# Altium schematic sheet Connectors.SchDoc: STM32 LoRa Node
size A4; Author: Leon Baždar; CompanyName: FER; Address1: Zagreb; Revision: V1.0; SheetNumber: 5; SheetTotal: 6
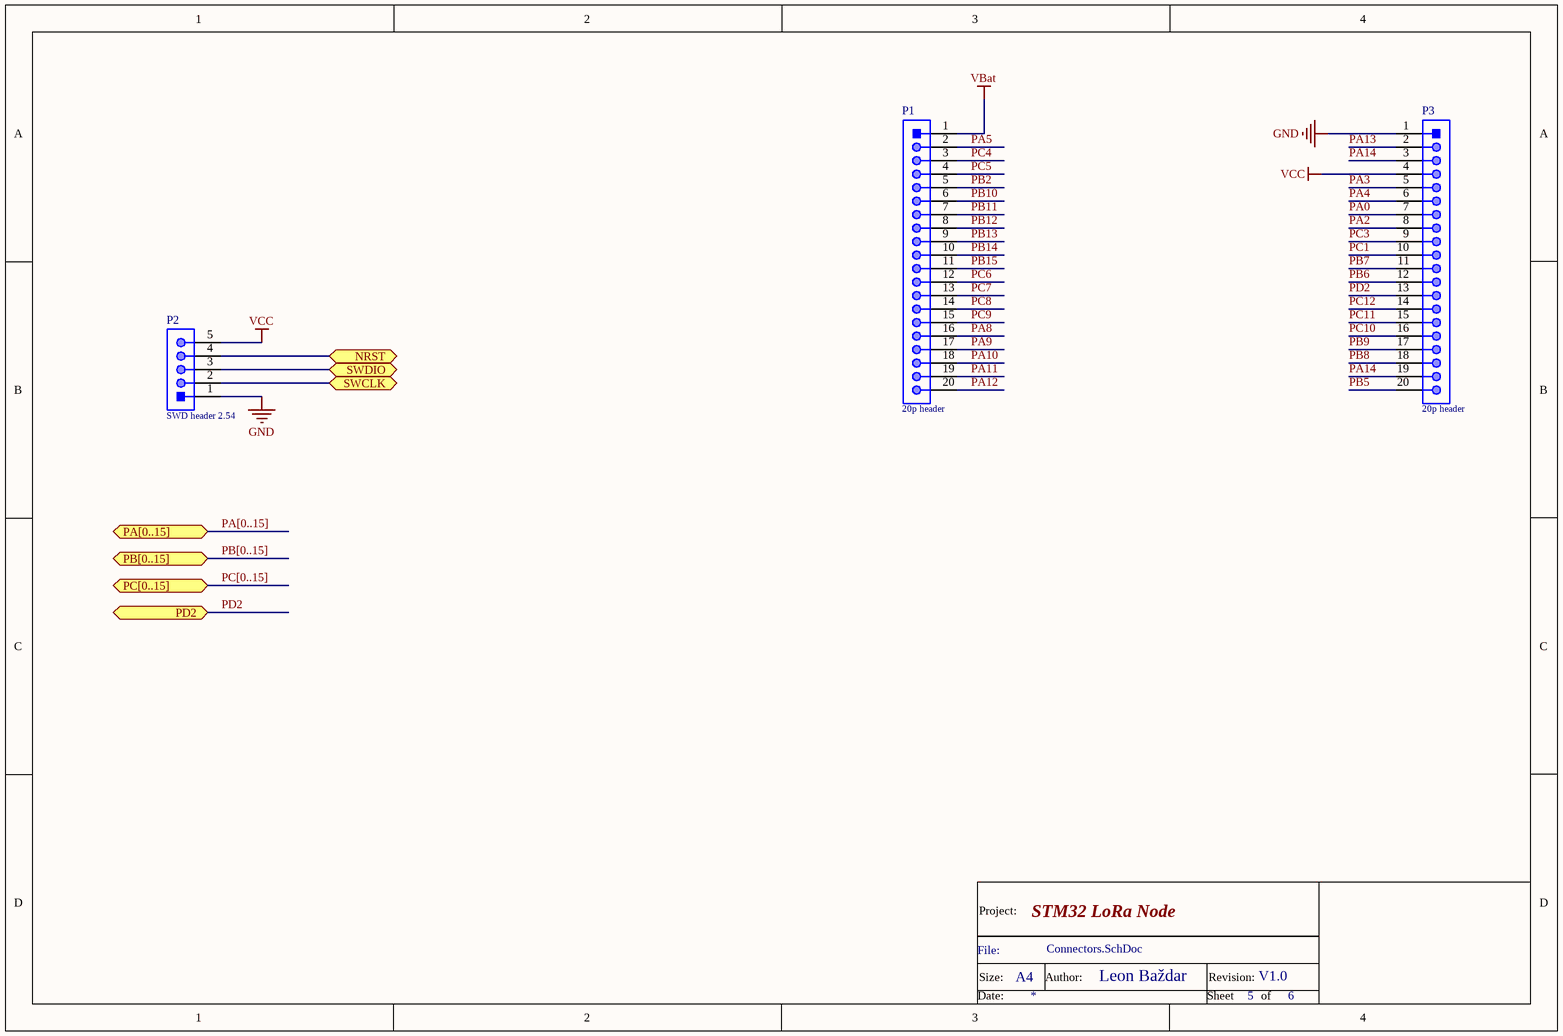
[diagram p0: Connectors.SchDoc]

## Parts
P1  20p header  [61302011121]
P2  SWD header 2.54  [61300511121]
P3  20p header  [61302011121]

## Ports
NRST (bidir), PA[0..15] (bidir), PB[0..15] (bidir), PC[0..15] (bidir), PD2 (bidir), SWCLK (bidir), SWDIO (bidir)

## Nets
GND: P2.1 P3.1
VBat: P1.1
VCC: P2.5 P3.4
NRST: P2.4 ; port NRST
PA0: P3.7
PA2: P3.8
PA3: P3.5
PA4: P3.6
PA5: P1.2
PA8: P1.16
PA9: P1.17
PA10: P1.18
PA11: P1.19
PA12: P1.20
PA13: P3.2
PA14: P3.3 P3.19
PB2: P1.5
PB5: P3.20
PB6: P3.12
PB7: P3.11
PB8: P3.18
PB9: P3.17
PB10: P1.6
PB11: P1.7
PB12: P1.8
PB13: P1.9
PB14: P1.10
PB15: P1.11
PC1: P3.10
PC3: P3.9
PC4: P1.3
PC5: P1.4
PC6: P1.12
PC7: P1.13
PC8: P1.14
PC9: P1.15
PC10: P3.16
PC11: P3.15
PC12: P3.14
PD2: P3.13 ; port PD2
SWCLK: P2.2 ; port SWCLK
SWDIO: P2.3 ; port SWDIO

## Buses and harness runs
bus PA[0..15] = port PA[0..15]
bus PB[0..15] = port PB[0..15]
bus PC[0..15] = port PC[0..15]

## Notes on the sheet
- Project:
- File:
- Size:
- A4
- Author:
- Revision:
- Date:
- Sheet
- of

## Library data of the parts
P1 P3 = CMP-1502-01102-1: THT Vertical Pin Header WR-PHD, Pitch 2.54 mm, Single Row, 20 pins; Manufacturer: Wurth Elektronik; Withstanding Voltage: 500VAC; Gender: Male; Pin Number: 20; Rated Current: 3A; Contact Resistance: 20mOhm; Pitch: 2.54mm; Working Voltage: 250VAC; Publisher: WurthElektronik; Packaging: Bag; Datasheet URL: https://katalog.we-online.de/em/datasheet/6130xx11121.pdf; Row Number: Single; Mounting Technology: THT; Manufacturer URL: http://www.we-online.de; Orientation: Vertical; Package Reference: 61302011121; Part Number: 61302011121; Operating Temperature: -40to105degC
P2 = CMP-1502-01068-1: THT Vertical Pin Header WR-PHD, Pitch 2.54 mm, Single Row, 5 pins; Manufacturer: Wurth Elektronik; Pin Number: 5; Contact Resistance: 20mOhm; Working Voltage: 250VAC; Pitch: 2.54mm; Withstanding Voltage: 500VAC; Rated Current: 3A; Gender: Male; Datasheet URL: https://katalog.we-online.de/em/datasheet/6130xx11121.pdf; Orientation: Vertical; Mounting Technology: THT; Row Number: Single; Package Reference: 61300511121; Publisher: WurthElektronik; Part Number: 61300511121; Packaging: Bag; Manufacturer URL: http://www.we-online.de; Operating Temperature: -40to105degC